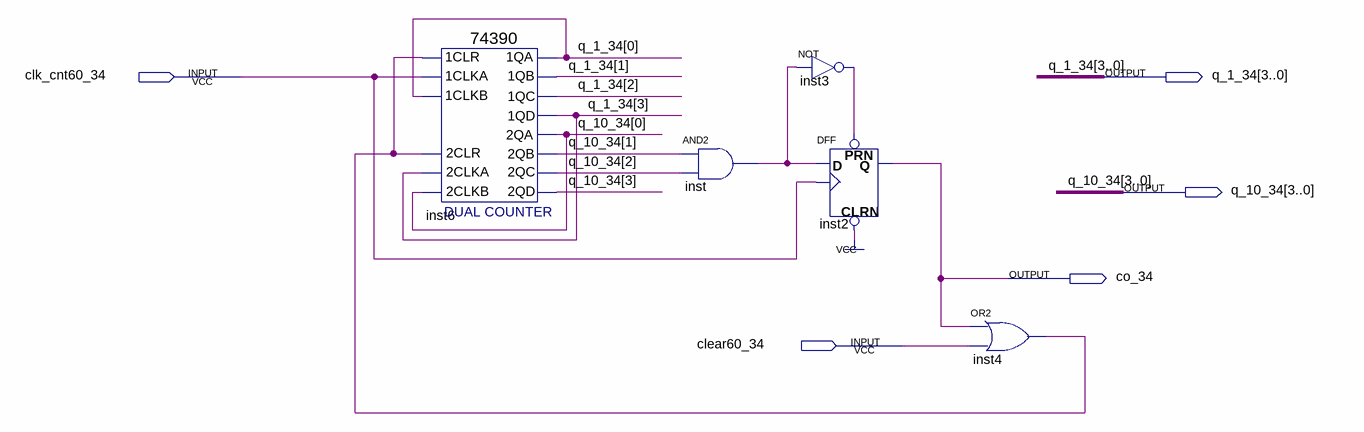
[diagram p0: schematic sheet]
// Quartus schematic cnt60_34.bdf as structural Verilog: 5 symbols, 5 pins
module cnt60_34 (
  input  clk_cnt60_34,
  input  clear60_34,
  output [3:0] q_1_34,
  output [3:0] q_10_34,
  output co_34
);

  wire inst3_out, inst4_out, inst_out;

  \74390  inst6 (
    .\2CLKA (q_1_34[3]), .\2CLR (inst4_out), .\2CLKB (q_10_34[0]), .\1CLR (inst4_out),
    .\1CLKA (clk_cnt60_34), .\1CLKB (q_1_34[0]), .\1QA (q_1_34[0]), .\1QB (q_1_34[1]), .\1QC (q_1_34[2]),
    .\1QD (q_1_34[3]), .\2QA (q_10_34[0]), .\2QB (q_10_34[1]), .\2QC (q_10_34[2]), .\2QD (q_10_34[3]));
  and inst (inst_out, q_10_34[1], q_10_34[2]);
  not inst3 (inst3_out, inst_out);
  DFF inst2 (.CLRN(1'b1), .CLK(clk_cnt60_34), .D(inst_out), .PRN(inst3_out), .Q(co_34));
  or inst4 (inst4_out, co_34, clear60_34);
endmodule
